# EAGLE design mapleCUx_large_310 (EAGLE 7.6.0)
MAPLE-CUx Large Version
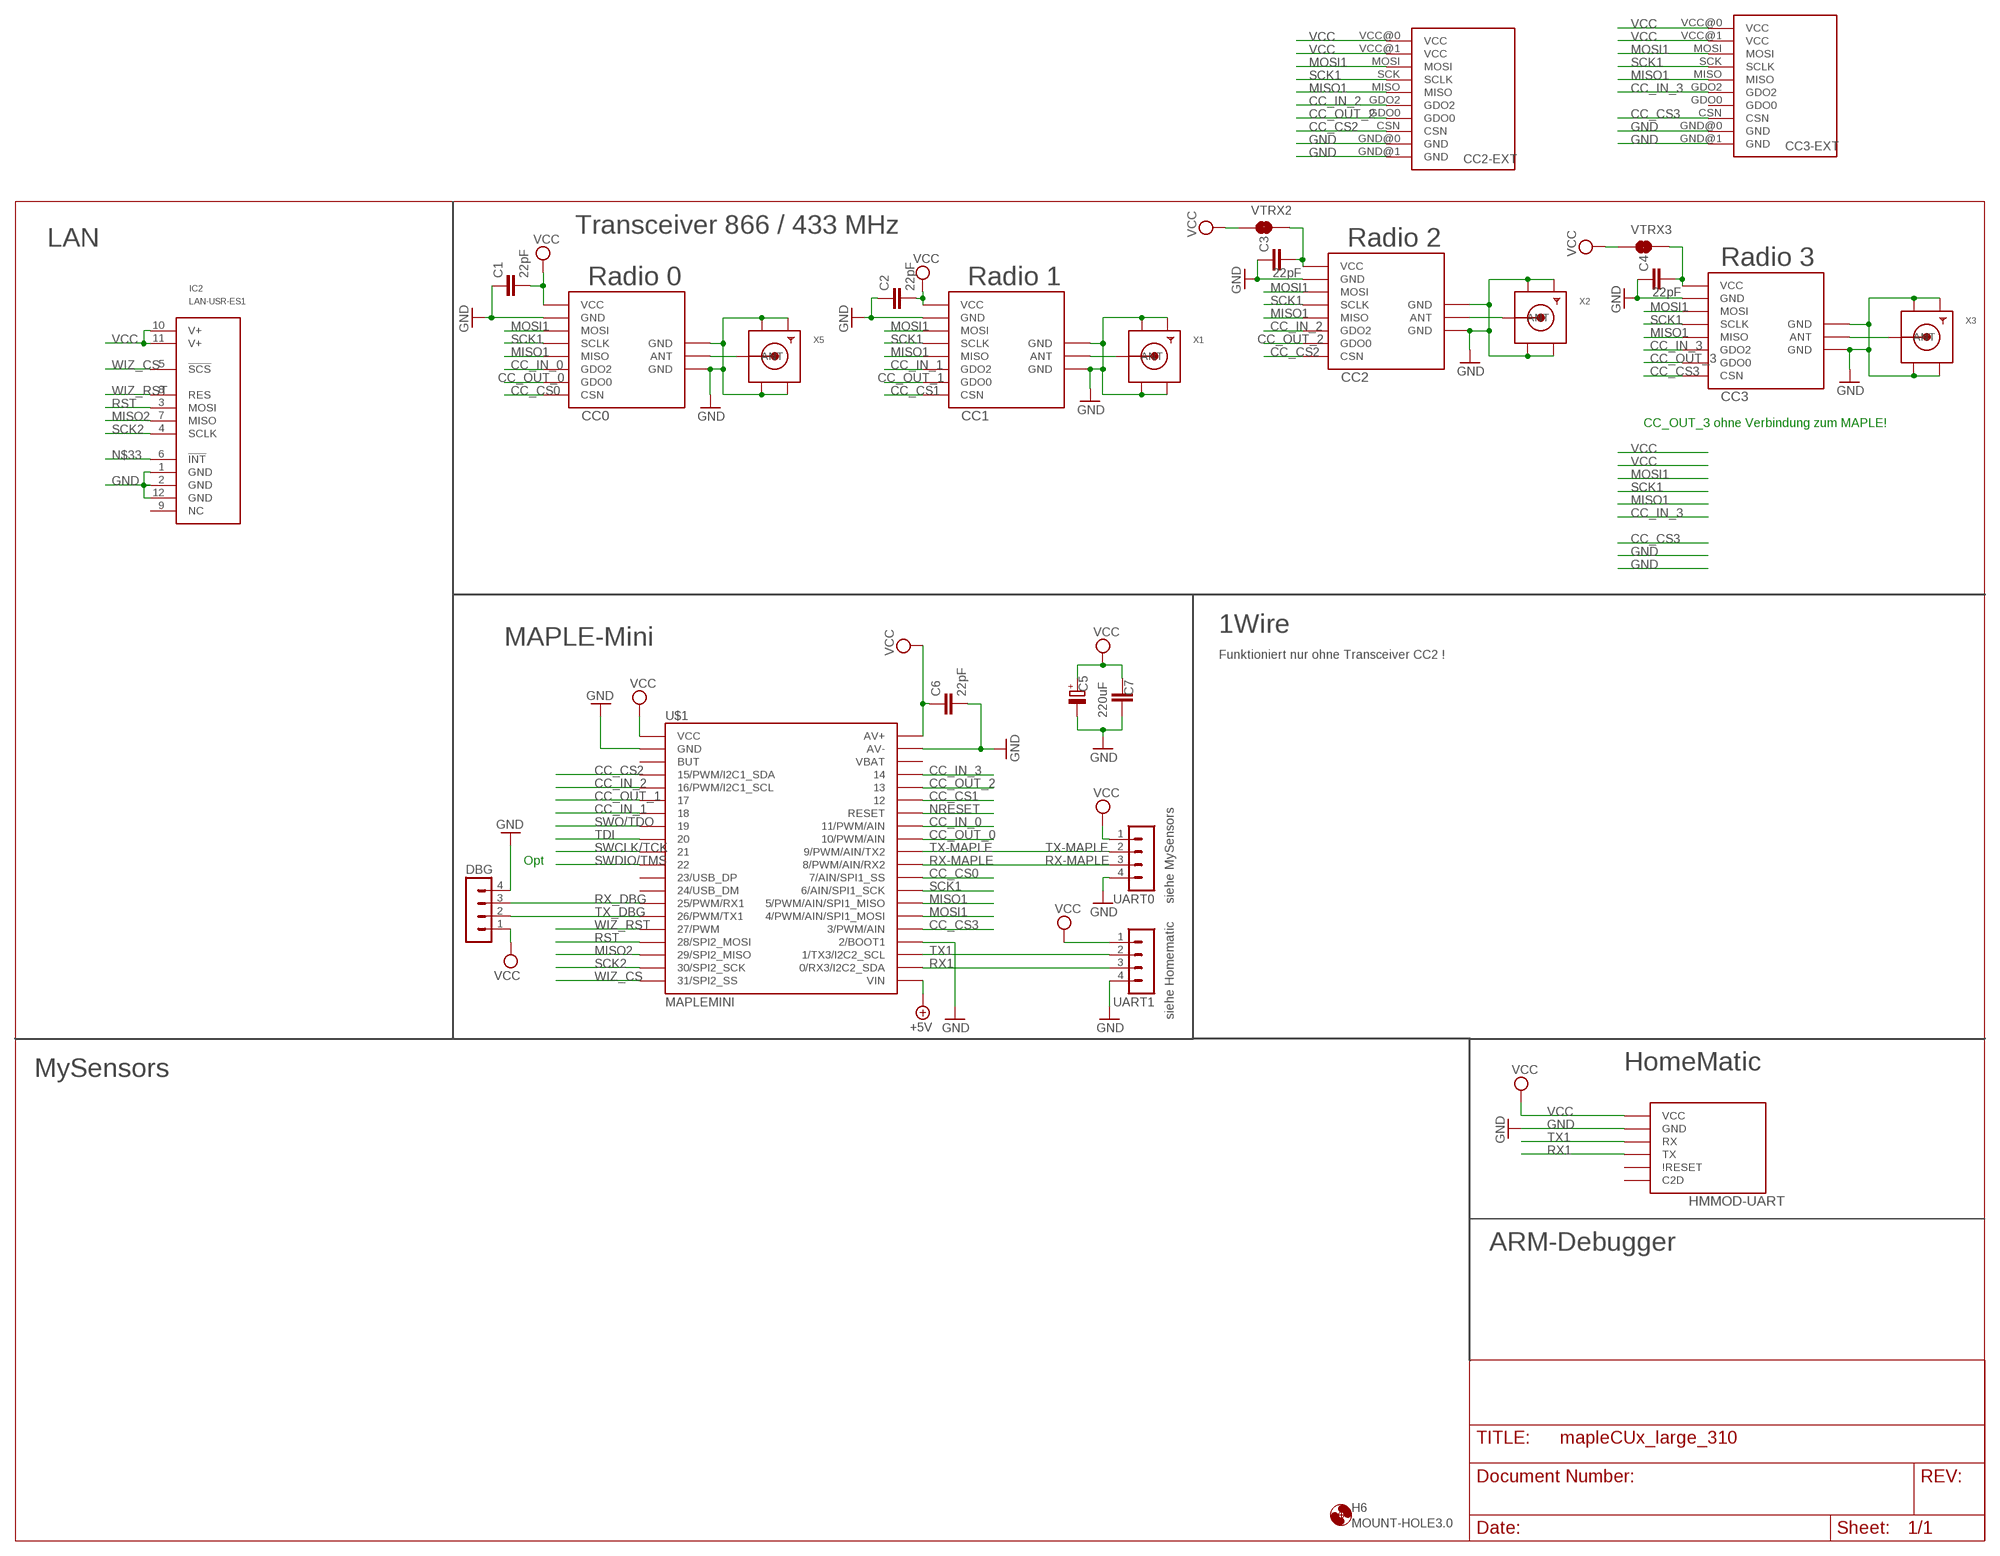
[diagram p0: schematic, sheet 1]

## Parts
C1  22pF  C-EUC0805  [C0805]
C2  22pF  C-EUC0805  [C0805]
C3  22pF  C-EUC0805  [C0805]
C4  22pF  C-EUC0805  [C0805]
C5  220uF  CPOL-EUE5-8.5  [E5-8,5]
C6  22pF  C-EUC0805  [C0805]
C7  C-EUC1812  [C1812]
CC0  CC1101  CC1101_MODULE1SMD  [CC1101_MODULE1_SMD]
CC1  CC1101_MODULE1SMD  [CC1101_MODULE1_SMD]
CC2  CC1101_MODULE1SMD  [CC1101_MODULE1_SMD]
CC2-EXT  CC1101_MODULE3_DIL  [CC1101_MODULE3_DIL]
CC3  CC1101_MODULE1SMD  [CC1101_MODULE1_SMD]
CC3-EXT  CC1101_MODULE3_DIL  [CC1101_MODULE3_DIL]
DBG  MA04-1  [MA04-1]
H6  MOUNT-HOLE3.0  [3,0]
HMMOD-UART  HM-MOD-UARTDIL  [HM-MOD-UART-DIL]
IC2  LAN-USR-ES1  [USR-ES1]
U$1  MAPLEMINI  [20-DIP]
UART0  MA04-1  [MA04-1]
UART1  MA04-1  [MA04-1]
VTRX2  JUMPER-SMT_2_NC_TRACE_SILK  [SMT-JUMPER_2_NC_TRACE_SILK]
VTRX3  JUMPER-SMT_2_NC_TRACE_SILK  [SMT-JUMPER_2_NC_TRACE_SILK]
X1  SMACONNECTOR_EDGE  [SMA_EDGELAUNCH]
X2  SMACONNECTOR_EDGE  [SMA_EDGELAUNCH]
X3  SMACONNECTOR_EDGE  [SMA_EDGELAUNCH]
X5  SMACONNECTOR_EDGE  [SMA_EDGELAUNCH]

## Nets
+5V [PWR]: U$1.21(VIN)
ANT0: CC0.ANT X5.P(ANT)
ANT1: CC1.ANT X1.P(ANT)
ANT2: CC2.ANT X2.P(ANT)
ANT3: CC3.ANT X3.P(ANT)
CC_CS0: CC0.CSN U$1.29(7/AIN/SPI1_SS)
CC_CS1: CC1.CSN U$1.35
CC_CS2: CC2-EXT.CSN CC2.CSN U$1.4(15/PWM/I2C1_SDA)
CC_CS3: CC3-EXT.CSN CC3.CSN U$1.25(3/PWM/AIN)
CC_IN_0: CC0.GDO2 U$1.33(11/PWM/AIN)
CC_IN_1: CC1.GDO2 U$1.7
CC_IN_2: CC2-EXT.GDO2 CC2.GDO2 U$1.5(16/PWM/I2C1_SCL)
CC_IN_3: CC3-EXT.GDO2 CC3.GDO2 U$1.37
CC_OUT_0: CC0.GDO0 U$1.32(10/PWM/AIN)
CC_OUT_1: CC1.GDO0 U$1.6
CC_OUT_2: CC2-EXT.GDO0 CC2.GDO0 U$1.36
CC_OUT_3: CC3.GDO0
GND [PWR]: C1.1 C2.1 C3.1 C4.1 C5.- C6.2 C7.1 CC0.GND@0(GND) CC0.GND@1(GND) CC0.GND@2(GND) CC1.GND@0(GND) CC1.GND@1(GND) CC1.GND@2(GND) CC2-EXT.GND@0(GND) CC2-EXT.GND@1(GND) CC2.GND@0(GND) CC2.GND@1(GND) CC2.GND@2(GND) CC3-EXT.GND@0(GND) CC3-EXT.GND@1(GND) CC3.GND@0(GND) CC3.GND@1(GND) CC3.GND@2(GND) DBG.4 HMMOD-UART.2(GND) IC2.1(GND) IC2.2(GND) IC2.12(GND) U$1.2(GND) U$1.24(2/BOOT1) U$1.39(AV-) UART0.4 UART1.4 X1.GND@1(GND4) X1.GND@2(GND3) X1.GND@3(GND2) X1.GND@4(GND1) X2.GND@1(GND4) X2.GND@2(GND3) X2.GND@3(GND2) X2.GND@4(GND1) X3.GND@1(GND4) X3.GND@2(GND3) X3.GND@3(GND2) X3.GND@4(GND1) X5.GND@1(GND4) X5.GND@2(GND3) X5.GND@3(GND2) X5.GND@4(GND1)
MISO1: CC0.MISO CC1.MISO CC2-EXT.MISO CC2.MISO CC3-EXT.MISO CC3.MISO U$1.27(5/PWM/AIN/SPI1_MISO)
MISO2: IC2.7(MISO) U$1.18(29/SPI2_MISO)
MOSI1: CC0.MOSI CC1.MOSI CC2-EXT.MOSI CC2.MOSI CC3-EXT.MOSI CC3.MOSI U$1.26(4/PWM/AIN/SPI1_MOSI)
N$1 [PWR]: C3.2 CC2.VCC VTRX2.2
N$3 [PWR]: C4.2 CC3.VCC VTRX3.2
N$33: IC2.6(!INT!)
NRESET: U$1.34(RESET)
RST: IC2.3(MOSI) U$1.17(28/SPI2_MOSI)
RX1: HMMOD-UART.5(TX) U$1.22(0/RX3/I2C2_SDA) UART1.3
RX-MAPLE: U$1.30(8/PWM/AIN/RX2) UART0.3
RX_DBG: DBG.3 U$1.14(25/PWM/RX1)
SCK1: CC0.SCLK CC1.SCLK CC2-EXT.SCK(SCLK) CC2.SCLK CC3-EXT.SCK(SCLK) CC3.SCLK U$1.28(6/AIN/SPI1_SCK)
SCK2: IC2.4(SCLK) U$1.19(30/SPI2_SCK)
SWCLK/TCK: U$1.10
SWDIO/TMS: U$1.11
SWO/TDO: U$1.8
TDI: U$1.9
TX1: HMMOD-UART.6(RX) U$1.23(1/TX3/I2C2_SCL) UART1.2
TX-MAPLE: U$1.31(9/PWM/AIN/TX2) UART0.2
TX_DBG: DBG.2 U$1.15(26/PWM/TX1)
VCC [PWR]: C1.2 C2.2 C5.+ C6.1 C7.2 CC0.VCC CC1.VCC CC2-EXT.VCC@0(VCC) CC2-EXT.VCC@1(VCC) CC3-EXT.VCC@0(VCC) CC3-EXT.VCC@1(VCC) DBG.1 HMMOD-UART.1(VCC) IC2.10(V+) IC2.11(V+) U$1.1(VCC) U$1.40(AV+) UART0.1 UART1.1 VTRX2.1 VTRX3.1
WIZ_CS: IC2.5(!SCS!) U$1.20(31/SPI2_SS)
WIZ_RST: IC2.8(RES) U$1.16(27/PWM)
Unconnected: CC3-EXT.GDO0 HMMOD-UART.3(C2D) HMMOD-UART.4(\!RESET) IC2.9(NC) U$1.3(BUT) U$1.12(23/USB_DP) U$1.13(24/USB_DM) U$1.38(VBAT)

## Notes on the sheet
- Transceiver 866 / 433 MHz
- LAN | Radio 2
- Radio 3
- Radio 0 | Radio 1
- CC_OUT_3 ohne Verbindung zum MAPLE!
- 1Wire
- MAPLE-Mini
- Funktioniert nur ohne Transceiver CC2 !
- Opt
- siehe MySensors
- siehe Homematic
- MySensors | HomeMatic
- ARM-Debugger

## Library data of the parts
C1-C4 C6 C7 = rcl:C-EU: CAPACITOR, European symbol
C5 = rcl:CPOL-EU: POLARIZED CAPACITOR, European symbol
CC0 CC1-CC3 = wireless:CC1101_MODULE1: CC1101 wireless module for 433/868 MHz (sold from Aliexpress). DIL version for mounting with pin header (and SMD soldering) and SMD only variant available.
CC2-EXT CC3-EXT = wireless:CC1101_MODULE3_DIL: 433 Mhz CC1101 wireless module named RF1101SE V3.1 package special has only limited silk screen on tPlace layer
DBG UART0 UART1 = con-lstb:MA04-1: PIN HEADER; OC_FARNELL: unknown; OC_NEWARK: unknown
H6 = holes:MOUNT-HOLE: MOUNTING HOLE with drill center marker
HMMOD-UART = wireless:HM-MOD-UART: eQ3 HM-MOD-UART-AW-SH2 wireless module for 868 MHz. DIL version for mounting with pin header (antenna upwards) and SMD variant available (antenna downwards).
IC2 = Martin-Communication:LAN-USR-ES1
U$1 = maplemini-small:MAPLEMINI
VTRX2 VTRX3 = SparkFun-Jumpers:JUMPER-SMT_2_NC_TRACE: Normally closed trace jumper This jumper has a trace between two pads so it's normally closed (NC). Use a razor knife to open the connection. For best results follow the IPC guidelines for cutting traces: Cutout at least 0.063 mm (0.005 in). Remove all loose material to clean up the cut area. Seal the cut with an approved epoxy. Reapply solder to reclose the connection.
X1-X3 X5 = adafruit:SMACONNECTOR: SMA Connector 90° DIP SMA Connector, 50 Ohm (4UConnector: 07259)

## Net classes
0 default: width 0.305 mm
1 PWR: width 0.457 mm

## Board
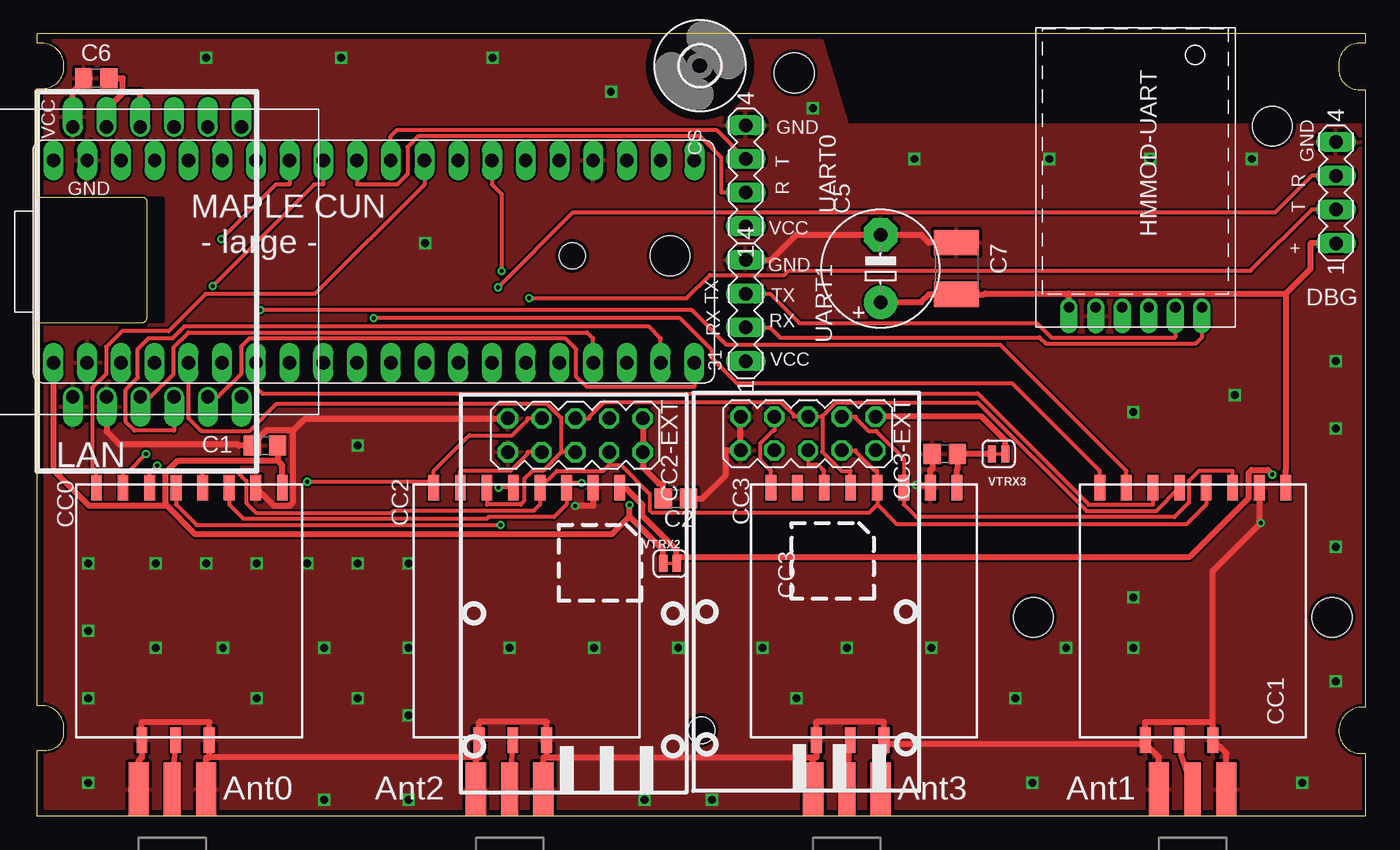
[diagram p1: board, top side]
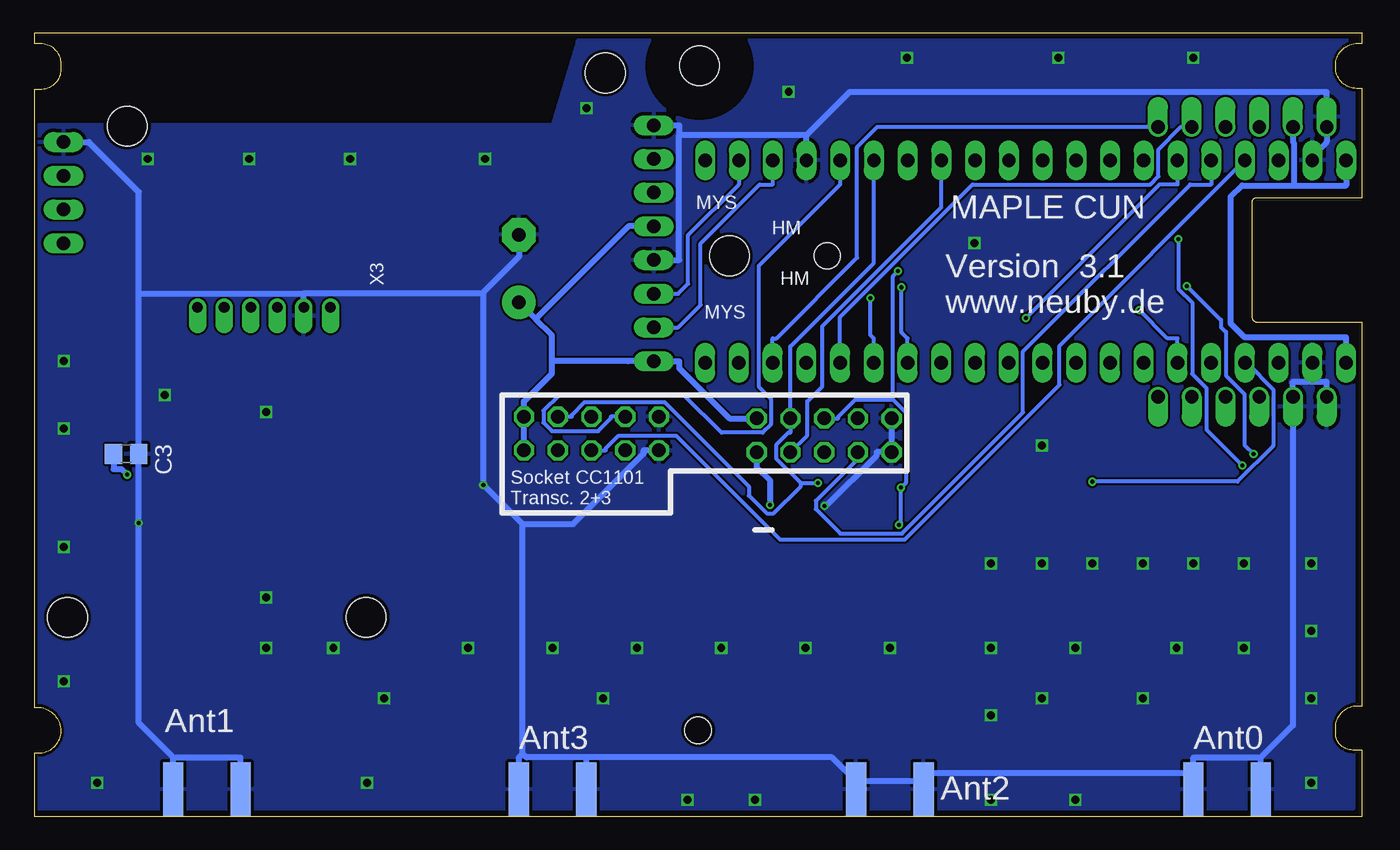
[diagram p2: board, bottom side, seen from below]

Size 100 x 59 mm. Coordinates in mm from the lower left corner, seen from the top.
Outline: 0,0 0,5 0.71,5 arc90 2,6.29 2,6.67 arc90 0.32,8.35 0,8.35 0,37.21 7.89,37.21 arc90 8.26,37.58 8.26,46.32 arc90 7.97,46.61 0,46.61 0,54.83 0.39,54.83 arc90 2,56.44 2,56.57 arc90 0.33,58.24 0,58.24 0,59 100,59 100,58.24 99.54,58.24 arc90 98,56.7 98,56.41 arc90 99.41,54.75 100,54.75 100,8.24 99.8,8.24 arc90 98,6.44 arc90 99.69,4.75 100,4.75 100,0 0,0
Copper layers (1*16): Top 0.035mm / dielectric 1.5mm / Bottom 0.035mm
Design rules "SeeedStudio_2layer_DRU_no_angle_20140221": minimum track width 6mil, minimum drill 12mil, track to track 6mil, track to pad 6mil, pad to pad 6mil, via to via 6mil, smd to smd 0mil, copper to edge 10mil, drill to drill 10mil, minimum pad ring 10mil, minimum via ring 6mil, stop-mask expansion 2mil, vias tented up to drill 100mil, thermal gap 10mil
Holes 2 mm at 50,6.5 40.28,42.23
Holes 3 mm at 47.65,42.23 93,52 57,56 75,15 97.5,15
tRestrict: area 0,37.3 to 9.4,46.5
bRestrict: area 0,37.3 to 9.4,46.5

### Footprints (pad centres in the part's own frame; a part is rotated, then mirrored left to right if it is on the bottom)
C0805 = smd 1.3 x 1.5: 1 -0.95,0; 2 0.95,0
E5-8,5 = drill 1.016 pad 2.54: + -2.54,0 | drill 1.016 pad 2.54 octagon: - 2.54,0
C1812 = smd 1.9 x 3.4: 1 -1.95,0; 2 1.95,0
CC1101_MODULE1_SMD = smd 1.93 x 0.813: ANT 19,5.96; CSN 0,0; GDO0 0,2; GDO2 0,4; GND@0 0,12; GND@1 19,8.5; GND@2 19,3.42; MISO 0,6; MOSI 0,10; SCLK 0,8; VCC 0,14
CC1101_MODULE3_DIL = drill 1.016 octagon: CSN 1.81,6.1; GDO0 4.35,6.1; GDO2 4.35,8.64; GND@0 1.81,3.56; GND@1 4.35,3.56; MISO 1.81,8.64; MOSI 1.81,11.18; SCK 4.35,11.18; VCC@0 1.81,13.72; VCC@1 4.35,13.72
MA04-1 = drill 1.016 long: 1 -3.81,0; 2 -1.27,0; 3 1.27,0; 4 3.81,0
3,0 = hole 3: 0,0
HM-MOD-UART-DIL = drill 0.8 offset: 1 0,12; 2 0,10; 3 0,8; 4 0,6; 5 0,4; 6 0,2
USR-ES1 = drill 1 pad 1.35 offset: 1 -10.16,5.715; 2 -10.16,3.175; 3 -10.16,0.635; 4 -10.16,-1.905; 5 -10.16,-4.445; 6 -10.16,-6.985; 7 10.16,-6.985; 8 10.16,-4.445; 9 10.16,-1.905; 10 10.16,0.635; 11 10.16,3.175; 12 10.16,5.715
20-DIP = drill 1.016 pad 1.27 long: 1 -24.13,-7.62; 2 -21.59,-7.62; 3 -19.05,-7.62; 4 -16.51,-7.62; 5 -13.97,-7.62; 6 -11.43,-7.62; 7 -8.89,-7.62; 8 -6.35,-7.62; 9 -3.81,-7.62; 10 -1.27,-7.62; 11 1.27,-7.62; 12 3.81,-7.62; 13 6.35,-7.62; 14 8.89,-7.62; 15 11.43,-7.62; 16 13.97,-7.62; 17 16.51,-7.62; 18 19.05,-7.62; 19 21.59,-7.62; 20 24.13,-7.62 | drill 1 pad 1.27 long: 21 24.13,7.62; 22 21.59,7.62; 23 19.05,7.62; 24 16.51,7.62; 25 13.97,7.62; 26 11.43,7.62; 27 8.89,7.62; 28 6.35,7.62; 29 3.81,7.62; 30 1.27,7.62; 31 -1.27,7.62; 32 -3.81,7.62; 33 -6.35,7.62; 34 -8.89,7.62; 35 -11.43,7.62; 36 -13.97,7.62; 37 -16.51,7.62; 38 -19.05,7.62; 39 -21.59,7.62; 40 -24.13,7.62
SMT-JUMPER_2_NC_TRACE_SILK = smd 0.635 x 1.27: 1 -0.508,0; 2 0.508,0
SMA_EDGELAUNCH = smd 4.064 x 1.524: GND@1 2.032,-2.54; GND@2 2.032,2.54 | smd 4.064 x 1.524 bottom: GND@3 2.032,2.54; GND@4 2.032,-2.54 | smd 4.064 x 1.27: P 2.032,0

### Placement (x,y rotation side)
C1  17.14,27.94 0 top
C2  48.08,23.95 180 top
C3  93.08,27.3 180 bottom
C4  68.33,27.3 0 top
C5  63.5,41.27 90 top
C6  4.45,55.61 180 top
C7  69.22,41.27 270 top
CC0  4.45,24.77 270 top
CC1  80.01,24.77 270 top
CC2  29.84,24.77 270 top
CC2-EXT  31.87,31.79 270 top
CC3  55.24,24.77 270 top
CC3-EXT  49.4,31.93 270 top
DBG  97.79,46.99 90 top
H6  49.89,56.55 0 top
HMMOD-UART  89.69,38.35 90 top
IC2  8.38,41.78 90 top
U$1  25.34,41.8 0 top
UART0  53.34,48.26 90 top
UART1  53.34,38.1 90 top
VTRX2  47.62,19.05 0 top
VTRX3  72.39,27.3 180 top
X1  87,0 90 top
X2  35.56,0 90 top
X3  60.96,0 90 top
X5  10.16,0 90 top

### Tracks (layer width: path | path; a pad name or v marks a point on that pad's centre or on a via)
ANT0
  Top 0.406: CC0.ANT X5.P
ANT1
  Top 0.406: CC1.ANT 86.11,5.76 86.11,4.7 X1.P
ANT2
  Top 0.406: CC2.ANT X2.P
ANT3
  Top 0.406: CC3.ANT X3.P
CC_CS0
  Top 0.305: CC0.CSN 4.45,26.04 4.14,26.34 4.14,32.3 5.18,33.34 5.18,35.36 6.38,36.56 9.87,36.56 12.66,39.35 20.89,39.35 29.15,47.61 U$1.29
CC_CS1  (via drill 0.3 pad 0.61)
  Top 0.305: v25.32,37.53 48.39,37.53 50.78,35.14 50.78,34.54 52.7,32.62 73.42,32.62 80.01,26.04 CC1.CSN
  Bottom 0.305: U$1.35 13.91,47.61 15.25,47.61 v25.32,37.53
CC_CS2  (via drill 0.3 pad 0.61)
  Top 0.305: 29.84,25.21 29.84,26.04 32.52,28.71 35.74,28.71 36.9,29.87 36.9,29.98 CC2-EXT.CSN | CC2.CSN 29.84,25.21 | v20.32,25.21 29.84,25.21
  Bottom 0.305: U$1.4 8.69,34.18 6.69,32.17 6.69,27.92 9.39,25.21 v20.32,25.21
CC_CS3
  Top 0.305: CC3.CSN 55.24,26.04 54.42,26.86 54.42,28.1 55.36,29.05 55.49,29.05 CC3-EXT.CSN
  Bottom 0.305: CC3-EXT.CSN 56.56,30.11 56.56,30 57.54,29.03 61.01,29.03 61.64,29.66 61.64,30.57 60.53,31.69 51.01,31.69 48.23,28.91 45.14,28.91 44.52,29.53 44.52,31.45 45.45,32.39 45.45,41.46 39.31,47.61 U$1.25
CC_IN_0  (via drill 0.3 pad 0.61)
  Top 0.305: v9.02,26.45 8.61,26.04 8.45,26.04 CC0.GDO2 | U$1.33 18.99,47.61 17.95,47.61 v13.83,43.49
  Bottom 0.305: v13.83,43.49 13.83,39.74 12.8,38.71 12.8,33.34 11.72,32.26 11.72,29.15 v9.02,26.45
CC_IN_1
  Top 0.305: U$1.7 16.45,32.35 16.94,31.86 70.81,31.86 79.18,23.5 84.01,23.5 CC1.GDO2
CC_IN_2
  Top 0.305: CC2.GDO2 33.84,23.5 36.39,23.5 36.66,23.77 36.66,25.42 37.28,26.04 38.07,26.04 39.44,27.4 39.44,27.48 | CC2-EXT.GDO2 39.44,27.44 39.44,27.48 | U$1.5 11.37,30.01 12.34,29.04 15.97,29.04 18.03,31.1 38.36,31.1 39.44,30.02 39.44,27.48
CC_IN_3
  Top 0.305: CC3-EXT.GDO2 58.03,26.51 58.77,26.51 59.24,26.04 CC3.GDO2
  Bottom 0.305: CC3-EXT.GDO2 56.97,27.57 56.97,27.71 55.99,28.69 51.66,28.69 43.83,20.86 34.45,20.86 22.8,32.51 22.8,35.45 U$1.37
CC_OUT_0  (via drill 0.3 pad 0.61)
  Top 0.305: CC0.GDO0 6.45,26.04 6.89,26.04 v8.17,27.31 | U$1.32 21.53,47.61 20.83,47.61 v13.19,39.96
  Bottom 0.305: v13.19,39.96 10.63,37.4 10.63,36.86 10.26,36.49 10.26,33.22 8.86,31.81 8.86,28 v8.17,27.31
CC_OUT_1  (via drill 0.3 pad 0.61)
  Top 0.305: v16.79,38.14 49.29,38.14 51.91,35.53 72.52,35.53 82.01,26.04 CC1.GDO0
  Bottom 0.305: U$1.6 13.91,36.01 14.65,36.01 v16.79,38.14
CC_OUT_2
  Top 0.305: CC2.GDO0 31.84,26.04 35.63,26.04 36.9,27.31 36.9,27.44 CC2-EXT.GDO0
  Bottom 0.305: CC2-EXT.GDO0 37.97,26.93 41.13,23.77 41.13,23.15 39.3,21.32 34.65,21.32 25.53,30.44 25.53,35.02 12.94,47.61 11.37,47.61 U$1.36
GND  (via drill 0.3 pad 0.61, 0.6)
  Top 0.457: CC2.GND@0 41.84,23.42 40.52,23.42 v40.48,23.38 | 67.25,24.98 67.25,26.11 67.31,26.17 67.38,26.17 C4.1 | CC3.GND@0 67.25,24.98 | v66.18,24.98 67.25,24.98 | 88.51,7.11 88.51,18.5 v92.12,22.12 92.01,22.23 CC1.GND@0 | 88.51,7.11 83.43,7.11 CC1.GND@2 83.43,5.47 | 63.74,5.47 83.43,5.47 | 88.51,7.11 CC1.GND@1 89.53,4.74 X1.GND@4 | 63.74,5.47 CC3.GND@1 63.74,7.11 58.66,7.11 CC3.GND@2 58.66,4.42 58.42,4.42 | 63.74,5.47 63.74,4.69 63.5,4.45 X3.GND@4 | 83.43,5.47 84.45,4.45 X1.GND@3 | C7.1 67.13,43.23 66.54,43.81 C5.- 57.15,43.81 55.24,41.91 UART1.4 | 38.34,4.45 38.34,4.42 58.42,4.42 | 38.34,4.45 CC2.GND@1 38.34,7.11 33.27,7.11 CC2.GND@2 33.27,4.42 33.02,4.42 | 38.34,4.45 38.1,4.45 X2.GND@1 | IC2.12 2.67,54.59 3.5,55.41 C6.2 | C2.1 50.06,23.95 51.81,25.7 51.81,27.57 CC3-EXT.GND@1 CC3-EXT.GND@0 | IC2.2 5.21,28.98 6.15,28.04 15.06,28.04 15.16,27.94 C1.1 16.2,28.05 17.22,29.07 19.25,29.07 | X5.GND@4 12.7,4.45 12.95,4.45 | X5.GND@3 7.62,4.17 7.87,4.42 CC0.GND@2 7.87,7.11 12.95,7.11 CC0.GND@1 12.95,4.45 | X3.GND@3 58.42,4.42 | X2.GND@3 33.02,4.42 | 33.02,4.42 | 33.02,4.42 32.99,4.45 12.95,4.45 | CC0.GND@0 17.79,23.42 19.01,23.42 19.25,23.66 19.25,29.07 | 19.25,29.07 20.16,29.98 CC2-EXT.GND@0
  Bottom 0.457: 66.18,39.39 66.18,39.49 63.5,42.16 C5.- | 66.18,39.39 v66.18,24.98 63.21,22.02 | 66.18,39.39 79.69,39.39 | 92.12,39.39 92.12,47.04 95.89,50.8 DBG.4 | 92.12,39.39 C3.1 v92.12,22.12 92.12,7.04 89.53,4.45 | 92.12,39.39 79.69,39.39 | HMMOD-UART.2 79.69,39.39 | v40.48,23.38 40.36,23.38 36.57,27.16 36.57,27.44 CC2-EXT.GND@1 CC2-EXT.GND@0 | CC3-EXT.GND@1 54.1,27.57 54.1,27.34 59.42,22.02 63.21,22.02 | 63.21,4.74 63.21,22.02 | 63.21,4.74 63.5,4.45 X3.GND@4 | 58.42,4.45 62.92,4.45 63.21,4.74 | 12.7,3.24 32.42,3.24 33.02,2.63 | 12.7,3.24 12.7,4.45 7.62,4.45 | X5.GND@4 12.7,3.24 | X1.GND@3 84.45,4.45 89.53,4.45 | X1.GND@4 89.53,4.45 | 41.85,51.31 38.57,54.59 2.67,54.59 IC2.12 2.67,50.81 3.75,49.73 U$1.39 | U$1.24 41.85,51.31 | X2.GND@3 33.02,2.63 | 33.02,2.63 38.1,2.63 | 38.1,2.63 39.91,4.45 58.42,4.45 | X2.GND@1 38.1,2.63 | X3.GND@3 58.42,4.45 | 3.75,32.76 5.21,32.76 IC2.2 5.21,6.86 7.62,4.45 | 3.75,32.76 U$1.2 | 3.75,32.76 2.67,32.76 IC2.1 | UART0.4 51.44,52.07 51.44,51.31 | 41.85,51.31 51.44,51.31 | UART1.4 51.44,41.91 51.44,51.31 | X5.GND@3 7.62,4.45
  other vias: 3.81,2.54 3.81,8.89 3.81,13.97 3.81,19.05 8.89,19.05 12.7,19.05 16.51,19.05 20.32,19.05 24.13,19.05 27.94,19.05 27.94,12.7 27.94,7.62 21.59,1.27 35.56,12.7 41.91,12.7 48.26,12.7 54.61,12.7 60.96,12.7 67.31,12.7 74.93,2.54 50.8,1.27 45.72,1.27 27.94,1.27 77.47,12.7 82.55,12.7 95.25,2.54 97.79,10.16 97.79,20.32 97.79,29.21 97.79,34.29 82.55,30.48 90.17,31.75 91.44,49.53 83.82,49.53 76.2,49.53 66.04,49.53 58.42,53.34 43.18,54.61 34.29,57.15 22.86,57.15 12.7,57.15 29.21,43.18 24.13,27.94 21.59,12.7 13.97,12.7 8.89,12.7 16.51,8.89 24.13,8.89 57.15,8.89 73.66,8.89 82.55,16.51
  pour Bottom: 0.64,0.64 0.64,58.42 59.05,58.42 60.96,52.07 99.69,52.07 99.69,0.64
  pour Top: 0.64,0.64 0.64,58.42 59.05,58.42 60.96,52.07 99.69,52.07 99.69,0.64
MISO1  (via drill 0.3 pad 0.61)
  Top 0.305: v34.88,21.95 11.99,21.95 10.45,23.5 CC0.MISO | v34.96,41.07 34.96,46.87 34.23,47.61 U$1.27 | 59.1,30.11 | 59.1,30.11 59.1,27.47 60.53,26.04 61.24,26.04 CC3.MISO | 59.1,30.11 59.1,30.18 60.12,31.2 70.82,31.2 79.01,23.01 84.25,23.01 CC1.MISO | 59.1,30.11 CC3-EXT.MISO 56.97,30.11 56.97,30.23 55.97,31.23 42.69,31.23 41.58,30.11 41.58,29.98 CC2-EXT.MISO | CC2.MISO v34.72,24.77
  Bottom 0.305: v34.88,21.95 34.72,22.11 v34.72,24.77 34.36,25.13 34.36,30.42 35.33,31.39 | 35.33,31.39 35.33,40.7 v34.96,41.07 | 35.33,31.39 38.16,31.39 39.44,30.11 39.44,29.98 CC2-EXT.MISO
MISO2
  Bottom 0.305: U$1.18 44.39,36.01 44.11,36.01 38.04,42.08 38.04,50.41 36.5,51.94 IC2.7
MOSI1  (via drill 0.3 pad 0.61)
  Top 0.305: v40.97,25.11 40.19,25.11 CC2.MOSI 39.84,23.5 38.91,22.56 33.98,22.56 33.84,22.41 15.53,22.41 14.45,23.5 CC0.MOSI | CC3-EXT.MOSI 61.64,30.11 61.64,29.98 62.58,29.05 63.15,29.05 65.25,26.95 CC3.MOSI 65.25,23.5 66.19,22.55 85.63,22.55 86.72,23.64 86.72,25.29 87.47,26.04 90.01,26.04 CC1.MOSI
  Bottom 0.305: 42.27,25.11 42.27,24.87 44.32,22.82 44.83,22.82 46.17,24.17 46.17,24.85 52.53,31.2 58.56,31.2 59.51,30.25 59.51,30.11 CC3-EXT.MOSI | 42.27,25.11 v40.97,25.11 | 42.27,25.11 44.12,26.96 44.12,27.97 43.18,28.91 43.05,28.91 CC2-EXT.MOSI 43.05,35.41 36.77,41.7 U$1.26
N$1  (via drill 0.3 pad 0.61)
  Top 0.457: 48.13,19.56 86.79,19.56 91.22,23.99 91.22,25.89 91.45,26.11 92.64,26.11 v93.01,25.75 | 48.13,19.56 48.13,20.07 45.58,22.62 45.58,23.46 44.27,24.77 CC2.VCC | VTRX2.2 48.13,19.56
  Bottom 0.457: C3.2 94.03,26.17 93.44,26.17 v93.01,25.75
N$3
  Top 0.457: CC3.VCC 69.25,26.11 69.28,26.15 C4.2 VTRX3.2
RST
  Top 0.305: IC2.3 8.54,31.62 10.26,33.34 10.26,35.34 11.38,36.47 41.39,36.47 41.85,36.01 U$1.17
RX1
  Top 0.305: HMMOD-UART.5 85.69,36.09 76.34,36.09 75.27,37.16 57.38,37.16 55.17,39.37 UART1.3
  Bottom 0.305: U$1.22 46.93,47.61 50.75,43.79 50.75,40.13 51.51,39.37 UART1.3
RX-MAPLE
  Top 0.305: U$1.30 26.61,51.23 27.06,51.69 51.18,51.69 UART0.3
RX_DBG  (via drill 0.3 pad 0.61)
  Top 0.305: v34.68,39.86 40.34,45.52 93.22,45.52 95.96,48.26 DBG.3
  Bottom 0.305: U$1.14 34.23,36.01 34.68,36.46 v34.68,39.86
SCK1
  Top 0.305: 63.24,23.5 64.69,22.05 86.57,22.05 88.01,23.5 CC1.SCLK | 43.05,26.47 43.94,26.47 46.11,24.31 46.11,23.07 46.29,22.89 62.64,22.89 63.24,23.5 | 43.05,26.47 42.62,26.04 39.12,26.04 CC2.SCLK 37.84,23.5 37.39,23.04 26.83,23.04 26.66,22.87 16.47,22.87 15.73,23.61 15.73,25.29 14.99,26.04 12.45,26.04 CC0.SCLK | 43.05,26.47 43.05,26.91 CC2-EXT.SCK | 63.24,23.5 CC3.SCLK 63.24,24.97 63.24,26.04 63.07,26.04 61.64,27.46 61.64,27.57 CC3-EXT.SCK
  Bottom 0.305: CC2-EXT.SCK 41.78,28.71 41.78,31.27 40.65,32.4 40.65,36.93 31.69,45.9 U$1.28
SCK2
  Top 0.305: U$1.19 46.93,36.01 46.01,36.92 11.08,36.92 10.18,36.02 8.38,36.02 7.56,35.2 7.56,33.05 6.66,32.16 6.66,29.71 7.31,29.06 10.29,29.06 IC2.4
TX1
  Top 0.305: HMMOD-UART.6 87.69,36.09 87.24,35.63 75.93,35.63 75.47,36.09 55.91,36.09 55.17,36.83 UART1.2
  Bottom 0.305: U$1.23 44.39,47.61 45.37,47.61 49.81,43.16 49.81,38.53 51.51,36.83 UART1.2
TX-MAPLE
  Top 0.305: U$1.31 24.07,47.61 27.1,47.61 27.88,48.38 27.88,50.43 28.68,51.23 49.91,51.23 51.51,49.63 51.51,46.99 UART0.2
TX_DBG  (via drill 0.3 pad 0.61)
  Top 0.305: DBG.2 95.96,45.72 91.34,41.1 56.58,41.1 56.26,40.78 50.64,40.78 48.89,39.04 v37.04,39.04
  Bottom 0.305: U$1.15 36.77,36.01 37.04,36.28 v37.04,39.04
VCC  (via drill 0.3 pad 0.61)
  Top 0.457: C5.+ 66.54,38.73 67.13,39.33 C7.2 71.3,39.33 71.36,39.39 77.69,39.39 | 94.01,39.39 95.89,41.26 95.89,43.18 DBG.1 | 77.69,39.39 94.01,39.39 | 94.01,39.39 94.01,26.11 CC1.VCC | 44.59,22.6 v44.59,23.47 | 44.59,22.6 47.12,20.07 VTRX2.1 | 44.59,22.6 43.25,21.26 11.88,21.26 9.66,23.48 | CC2-EXT.VCC@0 CC2-EXT.VCC@1 45.59,26.3 46.81,25.08 47.12,25.08 C2.2 | C6.1 6.43,55.61 6.43,54.58 6.47,54.53 | 6.47,54.53 6.53,54.59 7.75,54.59 IC2.10 | 6.47,54.53 5.21,53.27 IC2.11 | HMMOD-UART.1 77.69,39.39 | VTRX3.1 72.9,28.32 71.1,30.11 CC3-EXT.VCC@0 | C1.2 18.09,26.81 | CC0.VCC 18.45,26.46 18.09,26.81 | U$1.1 1.21,26.08 3.87,23.42 9.59,23.42 9.66,23.48 | 9.66,23.48 9.66,25.89 10.57,26.81 18.09,26.81
  Bottom 0.457: v44.59,23.47 44.59,25.29 45.59,26.3 CC2-EXT.VCC@1 | 62.23,37.47 C5.+ | 61.01,34.29 61.01,36.25 62.23,37.47 | 62.23,37.47 55.24,44.45 UART0.1 | 61.01,34.29 61.01,33.36 63.12,31.26 CC3-EXT.VCC@0 CC3-EXT.VCC@1 | 61.01,34.29 55.24,34.29 UART1.1 51.44,34.29 51.44,33.77 47.65,29.98 CC2-EXT.VCC@0 | U$1.1 1.21,36.08 8.84,36.08 9.9,37.14 9.9,46.67 9.04,47.53 5.11,47.53 | U$1.40 1.21,47.53 5.11,47.53 | 5.11,47.53 5.11,50.71 5.21,50.81 IC2.11
WIZ_CS
  Top 0.305: U$1.20 49.47,32.35 41.37,32.35 40.58,33.15 40.58,35.2 39.77,36.01 15.96,36.01 15.34,35.39 15.34,33.34 13.62,31.62 IC2.5
WIZ_RST
  Bottom 0.305: U$1.16 39.31,37.63 29.33,47.61 15.96,47.61 15.34,48.23 15.34,50.24 13.64,51.94 IC2.8

### Text on the board
tNames: CS | VCC | GND | T | GND | GND | R | R | VCC | T | + | MAPLE CUN / - large - | GND | TX | TX | RX | RX | 31 | VCC | LAN | CC3 | Ant0 | Ant2 | Ant3 | Ant1
bNames: MYS | MAPLE CUN | HM | HM | Version 3.1 / www.neuby.de | MYS | Socket CC1101 / Transc. 2+3 | Ant1 | Ant0 | Ant3 | Ant2